# Altium schematic sheet ETH-PHY.SchDoc: TE0729
size A4; Organization: Trenz Electronic GmbH; DocumentNumber: TE0706; Revision: 02; SheetNumber: 5; SheetTotal: 10; Date: 2016-06-28; Author: Vitali Tsiukala; DrawnBy: Vitali Tsiukala; Engineer: Vitali Tsiukala
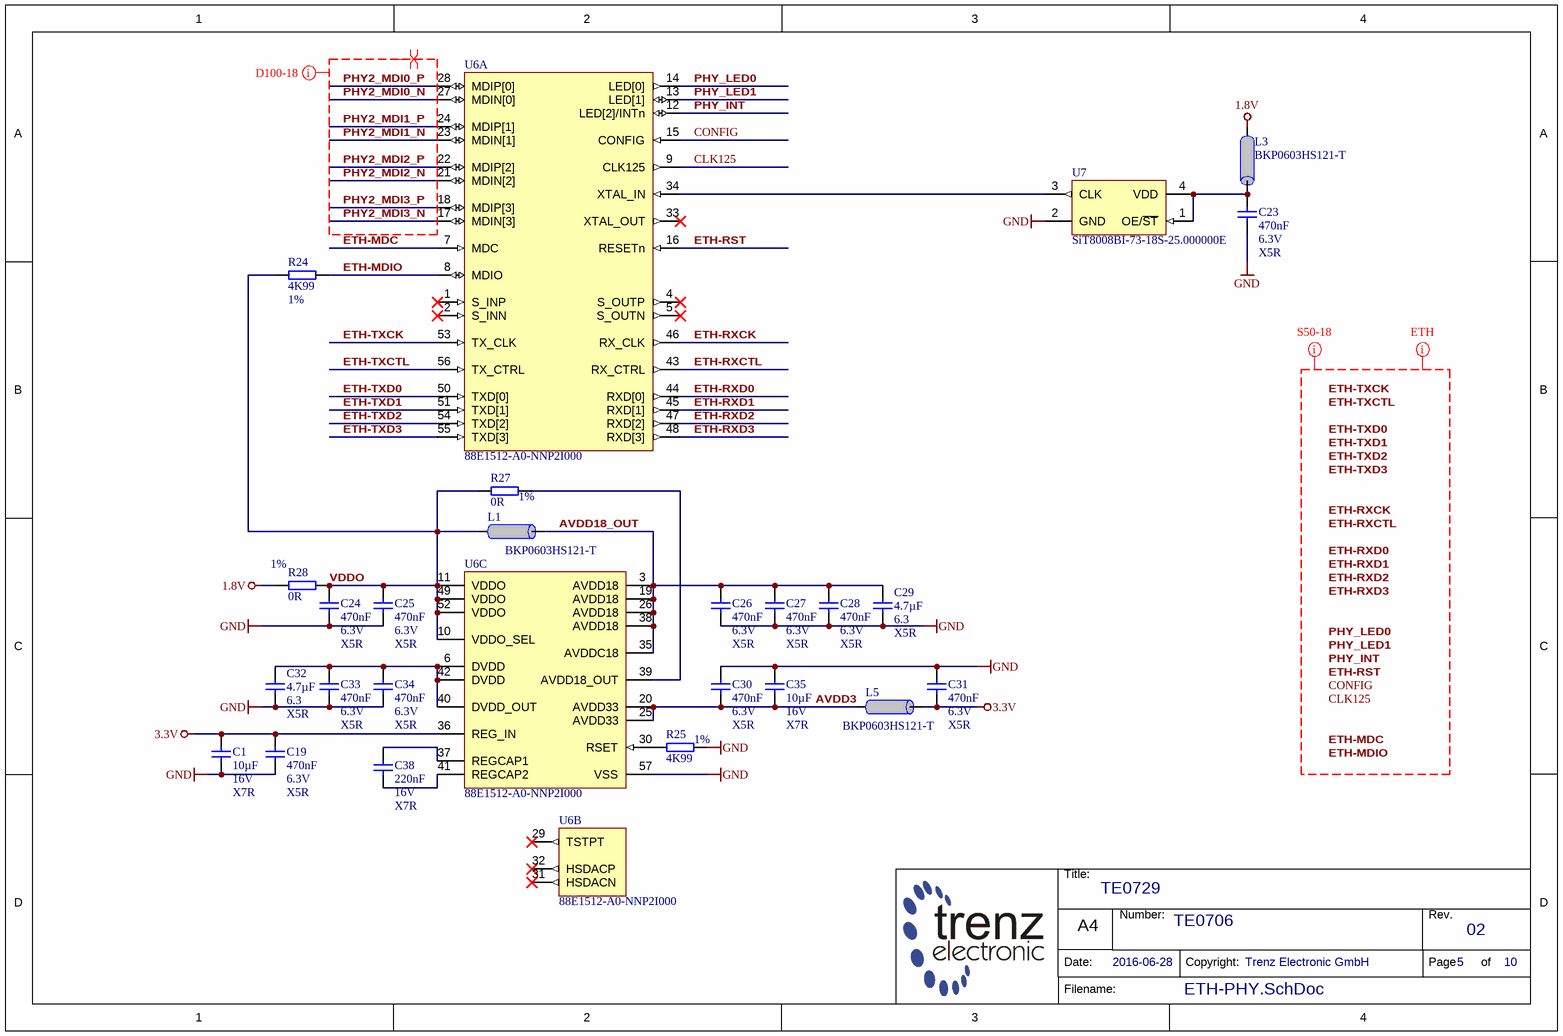
[diagram p0: ETH-PHY.SchDoc]

## Parts
C1  10µF  Voltage: 16V  Technology: X7R  [CAPC2012X135N]
C19  470nF  Voltage: 6.3V  Technology: X5R  [CAPC1005X55N]
C23  470nF  Voltage: 6.3V  Technology: X5R  [CAPC1005X55N]
C24  470nF  Voltage: 6.3V  Technology: X5R  [CAPC1005X55N]
C25  470nF  Voltage: 6.3V  Technology: X5R  [CAPC1005X55N]
C26  470nF  Voltage: 6.3V  Technology: X5R  [CAPC1005X55N]
C27  470nF  Voltage: 6.3V  Technology: X5R  [CAPC1005X55N]
C28  470nF  Voltage: 6.3V  Technology: X5R  [CAPC1005X55N]
C29  4.7µF  Voltage: 6.3  Technology: X5R  [CAPC1005X60N]
C30  470nF  Voltage: 6.3V  Technology: X5R  [CAPC1005X55N]
C31  470nF  Voltage: 6.3V  Technology: X5R  [CAPC1005X55N]
C32  4.7µF  Voltage: 6.3  Technology: X5R  [CAPC1005X60N]
C33  470nF  Voltage: 6.3V  Technology: X5R  [CAPC1005X55N]
C34  470nF  Voltage: 6.3V  Technology: X5R  [CAPC1005X55N]
C35  10µF  Voltage: 16V  Technology: X7R  [CAPC2012X135N]
C38  220nF  Voltage: 16V  Technology: X7R  [CAPC1005X55N]
L1  BKP0603HS121-T  [INDC0603X33N]
L3  BKP0603HS121-T  [INDC0603X33N]
L5  BKP0603HS121-T  [INDC0603X33N]
R24  4K99  Tolerance: 1%  [RESC1005X40N]
R25  4K99  Tolerance: 1%  [RESC1005X40N]
R27  0R  Tolerance: 1%  [RESC1005X40N]
R28  0R  Tolerance: 1%  [RESC1005X40N]
U6  88E1512-A0-NNP2I000  [QFN50P800X800X100-57N]  (parts A,B,C of 3)
U7  SiT8008BI-73-18S-25.000000E  [2016]

## Nets
1.8V: L3.1 R28.1
3.3V: C1.1 C19.1 C31.2 L5.2 U6.36(REG_IN)
GND: C1.2 C19.2 C23.2 C24.2 C25.2 C26.2 C27.2 C28.2 C29.2 C30.1 C31.1 C32.2 C33.2 C34.2 C35.1 R25.2 U6.57(VSS) U7.2(GND)
AVDD3: C30.2 C35.2 L5.1 U6.20(AVDD33) U6.25(AVDD33)
AVDD18_OUT: C26.1 C27.1 C28.1 C29.1 L1.2 U6.3(AVDD18) U6.19(AVDD18) U6.26(AVDD18) U6.35(AVDDC18) U6.38(AVDD18)
CLK125: U6.9(CLK125)
CONFIG: U6.15(CONFIG)
ETH-MDC: U6.7(MDC)
ETH-MDIO: R24.2 U6.8(MDIO)
ETH-RST: U6.16(RESETn)
ETH-RXCK: U6.46(RX_CLK)
ETH-RXCTL: U6.43(RX_CTRL)
ETH-RXD0: U6.44(RXD[0])
ETH-RXD1: U6.45(RXD[1])
ETH-RXD2: U6.47(RXD[2])
ETH-RXD3: U6.48(RXD[3])
ETH-TXCK: U6.53(TX_CLK)
ETH-TXCTL: U6.56(TX_CTRL)
ETH-TXD0: U6.50(TXD[0])
ETH-TXD1: U6.51(TXD[1])
ETH-TXD2: U6.54(TXD[2])
ETH-TXD3: U6.55(TXD[3])
PHY2_MDI0_N: U6.27(MDIN[0])
PHY2_MDI0_P: U6.28(MDIP[0])
PHY2_MDI1_N: U6.23(MDIN[1])
PHY2_MDI1_P: U6.24(MDIP[1])
PHY2_MDI2_N: U6.21(MDIN[2])
PHY2_MDI2_P: U6.22(MDIP[2])
PHY2_MDI3_N: U6.17(MDIN[3])
PHY2_MDI3_P: U6.18(MDIP[3])
PHY_INT: U6.12(LED[2]/INTn)
PHY_LED0: U6.14(LED[0])
PHY_LED1: U6.13(LED[1])
VDDO: C24.1 C25.1 L1.1 R24.1 R27.2 R28.2 U6.10(VDDO_SEL) U6.11(VDDO) U6.49(VDDO) U6.52(VDDO)
NetC23_1: C23.1 L3.2 U7.1(OE/~{ST}) U7.4(VDD)
NetC32_1: C32.1 C33.1 C34.1 U6.6(DVDD) U6.40(DVDD_OUT) U6.42(DVDD)
NetC38_1: C38.1 U6.37(REGCAP1)
NetC38_2: C38.2 U6.41(REGCAP2)
NetR25_1: R25.1 U6.30(RSET)
NetR27_1: R27.1 U6.39(AVDD18_OUT)
NetU6_34: U6.34(XTAL_IN) U7.3(CLK)

Not connected (* = marked no-connect by the designer): U6 1(S_INP)* 2(S_INN)* 4(S_OUTP)* 5(S_OUTN)* 29(TSTPT)* 31(HSDACN)* 32(HSDACP)* 33(XTAL_OUT)*

## Layout directives
differential pair: PHY2_MDI0_N, PHY2_MDI0_P, PHY2_MDI1_N, PHY2_MDI1_P, PHY2_MDI2_N, PHY2_MDI2_P, PHY2_MDI3_N, PHY2_MDI3_P
net class D100-18: PHY2_MDI0_N, PHY2_MDI0_P, PHY2_MDI1_N, PHY2_MDI1_P, PHY2_MDI2_N, PHY2_MDI2_P, PHY2_MDI3_N, PHY2_MDI3_P
net class S50-18: CLK125, CONFIG, ETH-MDC, ETH-MDIO, ETH-RST, ETH-RXCK, ETH-RXCTL, ETH-RXD0, ETH-RXD1, ETH-RXD2, ETH-RXD3, ETH-TXCK, ETH-TXCTL, ETH-TXD0, ETH-TXD1, ETH-TXD2, ETH-TXD3, PHY_INT, PHY_LED0, PHY_LED1
net class ETH: CLK125, CONFIG, ETH-MDC, ETH-MDIO, ETH-RST, ETH-RXCK, ETH-RXCTL, ETH-RXD0, ETH-RXD1, ETH-RXD2, ETH-RXD3, ETH-TXCK, ETH-TXCTL, ETH-TXD0, ETH-TXD1, ETH-TXD2, ETH-TXD3, PHY_INT, PHY_LED0, PHY_LED1

## Notes on the sheet
- Labels drawn without touching a wire or pin: CLK125, CONFIG, ETH-MDC, ETH-MDIO, ETH-RST, ETH-RXCK, ETH-RXCTL, ETH-RXD0, ETH-RXD1, ETH-RXD2, ETH-RXD3, ETH-TXCK, ETH-TXCTL, ETH-TXD0, ETH-TXD1, ETH-TXD2, ETH-TXD3, PHY_INT, PHY_LED0, PHY_LED1
- Title:
- Number:
- Rev.
- Date:
- A4
- Copyright:
- Page
- of
- Filename:

## Library data of the parts
C1 C35 = 24380: KON 10µF 16V X7R SMD 10%; AN: 24380; Mixed: SMT; Value: 10u; Preferred: Yes; Case: 2012 (0805); Tolerance: 10%
C19 C24-C28 C30 C31 C33 C34 = 23659: KON 470nF 6,3V X5R SMD; AN: 23659; Value: 470n; Mixed: SMT; Preferred: Yes; Case: 1005 (0402)
C23 = 23659: KON 470nF 6,3V X5R SMD; AN: 23659; Mixed: SMT; Value: 470n; Preferred: Yes; Case: 1005 (0402)
C29 C32 = 24719: KON 4.7µF 6.3V X5R SMD 20%; AN: 24719; Value: 4.7u; Mixed: SMT; Preferred: Yes; Case: 1005 (0402); Tolerance: 20%
C38 = 22768: KON 220nF 16V X7R SMD; AN: 22768; Mixed: SMT; Value: 220n; Case: 1005 (0402)
L1 L5 = 25393: Ferritdurchführung SMD 0201; AN: 25393; Mixed: SMT; Preferred: Yes; Tolerance: 25%; Case: 0603 (0201); HelpURL: B:\AD\adlib\datasheet\MULTILAYER CHIP BEAD INDUCTORS BK; Trenz-Stock: Yes; H-ART: BKP0603HS121-T
L3 = 25393: Ferritdurchführung SMD 0201; AN: 25393; Mixed: SMT; Trenz-Stock: Yes; Tolerance: 25%; Case: 0603 (0201); HelpURL: B:\AD\adlib\datasheet\MULTILAYER CHIP BEAD INDUCTORS BK; Preferred: Yes; H-ART: BKP0603HS121-T
R24 = 22754: WID SMD 4K99 1% 0,063W; AN: 22754; Mixed: SMT; Value: 4.99K; Preferred: Yes; Case: 1005 (0402); Technology: TK100
R25 = 22754: WID SMD 4K99 1% 0,063W; AN: 22754; Value: 4.99K; Mixed: SMT; Preferred: Yes; Case: 1005 (0402); Technology: TK100
R27 R28 = 22738: WID SMD 0R; AN: 22738; Mixed: SMT; Value: 0; Preferred: Yes; Case: 1005 (0402); Technology: TK100
U6 = 24652: AN: 24652; Trenz-Stock: Yes; Mixed: SMT; Case: QFN56; HelpURL: B:\AD\adlib\datasheet\NDA\88E1512; Preferred: Yes; H-ART: 88E1512-A0-NNP2I000
U7 = 27228: AN: 27228; Mixed: SMT; Value: 25M; Voltage: 1.8V; Preferred: Yes; Case: 2.0  x 1.6mm; HelpURL: B:\AD\adlib\datasheet\SiT8008; H-ART: SIT8008BI-73-18S-25.000000E